# Altium schematic sheet ALERT.SchDoc
size A; SheetNumber: 4; SheetTotal: 5
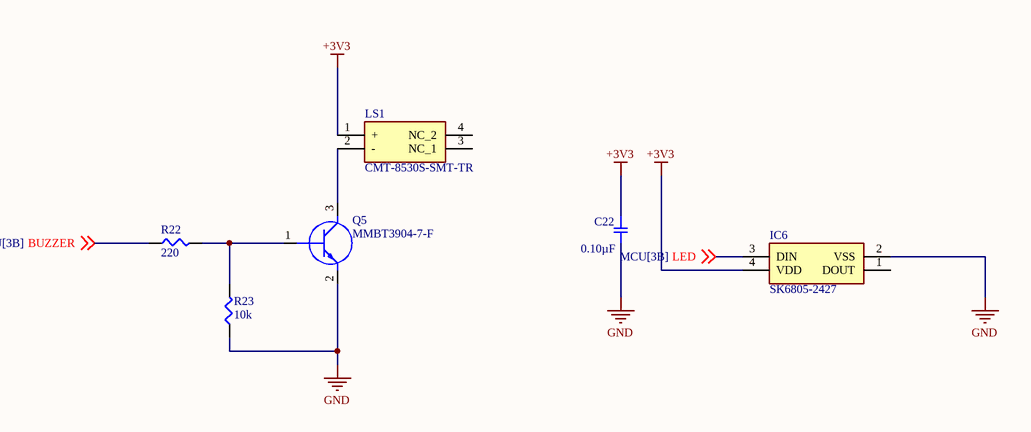
[diagram p0: ALERT.SchDoc]

## Parts
C22  0.10µF  [SMD-0402C]
IC6  SK6805-2427  [SK68052427]
LS1  CMT-8530S-SMT-TR  [CMT8530SSMTTR]
Q5  MMBT3904-7-F  [SOT96P240X110-3N]
R22  220  [SMD-0402-RES]
R23  10k  [SMD-0402-RES]

## Nets
+3V3: C22.1 IC6.4(VDD) LS1.1(+)
GND: C22.2 IC6.2(VSS) Q5.2(E) R23.1
BUZZER: R22.1 ; off-sheet BUZZER
LED: IC6.3(DIN) ; off-sheet LED
NetLS1_2: LS1.2(-) Q5.3(C)
NetQ5_1: Q5.1(B) R22.2 R23.2

Not connected (* = marked no-connect by the designer): IC6 1(DOUT); LS1 3(NC_1) 4(NC_2)

## Library data of the parts
C22 = GCM155R71C104KA55D: CAP CER 0.1UF 16V X7R 0402; Manufacturer: Murata Electronics North America; Factory Stock: 0; Unit Price (USD): 0.1; Minimum Quantity: 1; Tolerance: ±10%; Datasheets: http://www.murata.com/~/media/webrenewal/support/library/catalog/products/capacitor/mlcc/c03e.ashx; Image: //media.digikey.com/Renders/Murata%20Renders/ZRB-SERIES-0402.jpg; Digi-Key Part Number: 490-4759-1-ND; Part Number: GCM155R71C104KA55D; Quantity Available: 734194; @ qty: 0; Packaging: Cut Tape (CT); Series: GCM; Part Status: Active; Value: 0.10µF; Voltage: 16V; Temperature Coefficient: X7R; Operating Temperature: -55°C ~ 125°C; Features: -; Ratings: AEC-Q200; Applications: Automotive; Mounting Type: Surface Mount, MLCC; Package / Case: 0402 (1005 Metric); Size / Dimension: 0.039" L x 0.020" W (1.00mm x 0.50mm); Height - Seated (Max): -; Thickness (Max): 0.022" (0.55mm); Lead Spacing: -; Lead Style: -
IC6 = SK6805-2427: Integrated Circuit; Manufacturer_Name: Adafruit; Datasheet Link: https://cdn-shop.adafruit.com/product-files/3484/3484_Datasheet.pdf; Height: 1.1mm; Manufacturer_Part_Number: SK6805-2427
LS1 = CMT-8530S-SMT-TR: Loudspeaker or Buzzer; Manufacturer_Name: Same Sky; Datasheet Link: https://www.sameskydevices.com/product/resource/supplyframepdf/cmt-8530s-smt-tr.pdf; Height: 3.5mm; Manufacturer_Part_Number: CMT-8530S-SMT-TR; Mouser Part Number: 490-CMT-8530S-SMT-TR; Mouser Price/Stock: https://www.mouser.co.uk/ProductDetail/Same-Sky/CMT-8530S-SMT-TR?qs=qCxwlXJ4fnxl6A4lXsnRBQ%3D%3D; Arrow Part Number: CMT-8530S-SMT-TR; Arrow Price/Stock: https://www.arrow.com/en/products/cmt-8530s-smt-tr/cui-devices?utm_currency=USD&region=nac
Q5 = MMBT3904-7-F: Transistor BJT NPN; Manufacturer_Name: Diodes Incorporated; Datasheet Link: https://www.diodes.com//assets/Datasheets/MMBT3904.pdf; Height: 1.1mm; Manufacturer_Part_Number: MMBT3904-7-F; Mouser Part Number: 621-MMBT3904-F; Mouser Price/Stock: https://www.mouser.co.uk/ProductDetail/Diodes-Incorporated/MMBT3904-7-F?qs=7F%2FY8wl6X3H3eL7tHVWSBQ%3D%3D; Arrow Part Number: MMBT3904-7-F; Arrow Price/Stock: https://www.arrow.com/en/products/mmbt3904-7-f/diodes-incorporated?utm_currency=USD&region=europe
R22 = ERJ-2RKF2200X: RES SMD 220 OHM 1% 1/10W 0402; Manufacturer: Panasonic Electronic Components; Factory Stock: 0; Unit Price (USD): 0.00496; @ qty: 1500; Minimum Quantity: 1; Power (Watts): 0.1W, 1/10W; Temperature Coefficient: ±100ppm/°C; Part Number: ERJ-2RKF2200X; Datasheets: http://industrial.panasonic.com/www-cgi/jvcr13pz.cgi?E+PZ+3+AOA0002+ERJ2RKF2200X+7+WW; Image: //media.digikey.com/Photos/Panasonic%20Photos/ERJ-PA2-Series.jpg; Digi-Key Part Number: P220LCT-ND; Quantity Available: 432220; Packaging: Cut Tape (CT); Series: ERJ; Part Status: Active; Value: 220; Tolerance: ±1%; Composition: Thick Film; Features: Automotive AEC-Q200; Operating Temperature: -55°C ~ 155°C; Package / Case: 0402 (1005 Metric); Supplier Device Package: 0402; Size / Dimension: 0.039" L x 0.020" W (1.00mm x 0.50mm); Height - Seated (Max): 0.016" (0.40mm); Number of Terminations: 2; Failure Rate: -
R23 = ERJ-2GEJ103X: RES SMD 10K OHM 5% 1/10W 0402; Manufacturer: Panasonic Electronic Components; Factory Stock: 0; Unit Price (USD): 0.00350; @ qty: 1500; Minimum Quantity: 1; Power (Watts): 0.1W, 1/10W; Temperature Coefficient: ±200ppm/°C; Part Number: ERJ-2GEJ103X; Datasheets: http://industrial.panasonic.com/www-cgi/jvcr13pz.cgi?E+PZ+3+AOA0001+ERJ2GEJ103X+7+WW; Image: //media.digikey.com/Photos/Panasonic%20Photos/ERJ-PA2-Series.jpg; Digi-Key Part Number: P10KJCT-ND; Quantity Available: 2560215; Packaging: Cut Tape (CT); Series: ERJ; Part Status: Active; Value: 10k; Tolerance: ±5%; Composition: Thick Film; Features: Automotive AEC-Q200; Operating Temperature: -55°C ~ 155°C; Package / Case: 0402 (1005 Metric); Supplier Device Package: 0402; Size / Dimension: 0.039" L x 0.020" W (1.00mm x 0.50mm); Height - Seated (Max): 0.016" (0.40mm); Number of Terminations: 2; Failure Rate: -